# Altium schematic sheet MainCore.SchDoc
size A3
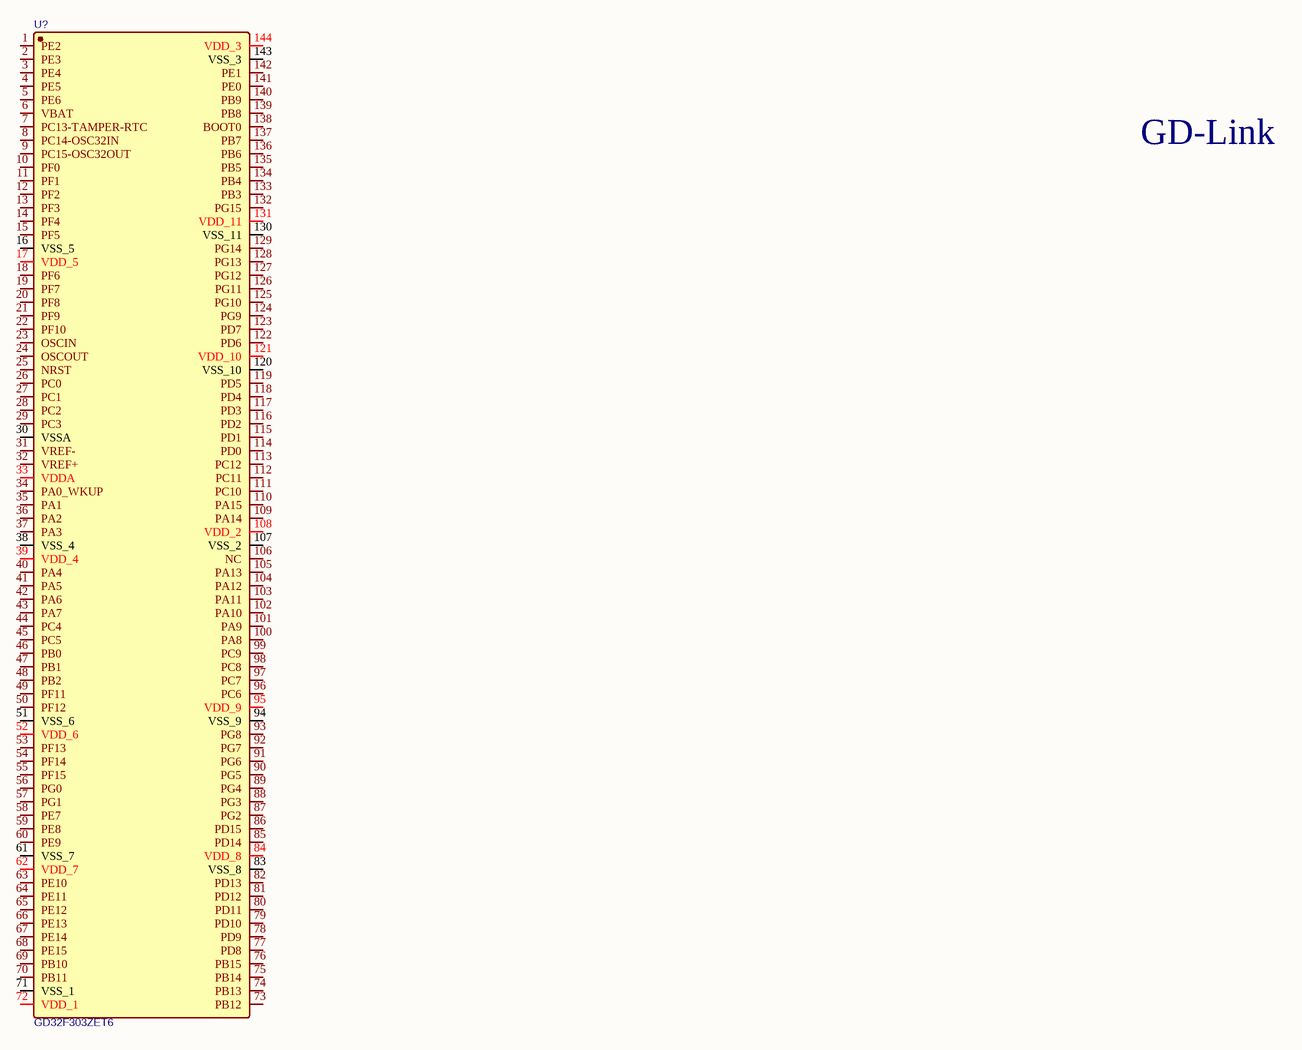
[diagram p0: MainCore.SchDoc]

## Parts
U?  GD32F303ZET6  [LQFP144 20X20]

## Nets

Not connected (* = marked no-connect by the designer): U? 1(PE2) 2(PE3) 3(PE4) 4(PE5) 5(PE6) 6(VBAT) 7(PC13-TAMPER-RTC) 8(PC14-OSC32IN) 9(PC15-OSC32OUT) 10(PF0) 11(PF1) 12(PF2) 13(PF3) 14(PF4) 15(PF5) 16(VSS_5) 17(VDD_5) 18(PF6) 19(PF7) 20(PF8) 21(PF9) 22(PF10) 23(OSCIN) 24(OSCOUT) 25(NRST) 26(PC0) 27(PC1) 28(PC2) 29(PC3) 30(VSSA) 31(VREF-) 32(VREF+) 33(VDDA) 34(PA0_WKUP) 35(PA1) 36(PA2) 37(PA3) 38(VSS_4) 39(VDD_4) 40(PA4) 41(PA5) 42(PA6) 43(PA7) 44(PC4) 45(PC5) 46(PB0) 47(PB1) 48(PB2) 49(PF11) 50(PF12) 51(VSS_6) 52(VDD_6) 53(PF13) 54(PF14) 55(PF15) 56(PG0) 57(PG1) 58(PE7) 59(PE8) 60(PE9) 61(VSS_7) 62(VDD_7) 63(PE10) 64(PE11) 65(PE12) 66(PE13) 67(PE14) 68(PE15) 69(PB10) 70(PB11) 71(VSS_1) 72(VDD_1) 73(PB12) 74(PB13) 75(PB14) 76(PB15) 77(PD8) 78(PD9) 79(PD10) 80(PD11) 81(PD12) 82(PD13) 83(VSS_8) 84(VDD_8) 85(PD14) 86(PD15) 87(PG2) 88(PG3) 89(PG4) 90(PG5) 91(PG6) 92(PG7) 93(PG8) 94(VSS_9) 95(VDD_9) 96(PC6) 97(PC7) 98(PC8) 99(PC9) 100(PA8) 101(PA9) 102(PA10) 103(PA11) 104(PA12) 105(PA13) 106(NC) 107(VSS_2) 108(VDD_2) 109(PA14) 110(PA15) 111(PC10) 112(PC11) 113(PC12) 114(PD0) 115(PD1) 116(PD2) 117(PD3) 118(PD4) 119(PD5) 120(VSS_10) 121(VDD_10) 122(PD6) 123(PD7) 124(PG9) 125(PG10) 126(PG11) 127(PG12) 128(PG13) 129(PG14) 130(VSS_11) 131(VDD_11) 132(PG15) 133(PB3) 134(PB4) 135(PB5) 136(PB6) 137(PB7) 138(BOOT0) 139(PB8) 140(PB9) 141(PE0) 142(PE1) 143(VSS_3) 144(VDD_3)

## Notes on the sheet
- GD-Link

## Library data of the parts
U? = GD32F303ZET6: BOM_Manufacturer: GigaDevice Semicon Beijing; Contributor: LCSC; BOM_Supplier: LCSC; BOM_Supplier Part: C962267; BOM_Manufacturer Part: GD32F303ZET6; BOM_JLCPCB Part Class: Extended Part; spicePre: U; spiceSymbolName: GD32F303ZET6